# EAGLE design DC24_HHV_RE-revp1 (EAGLE 6.5.0)
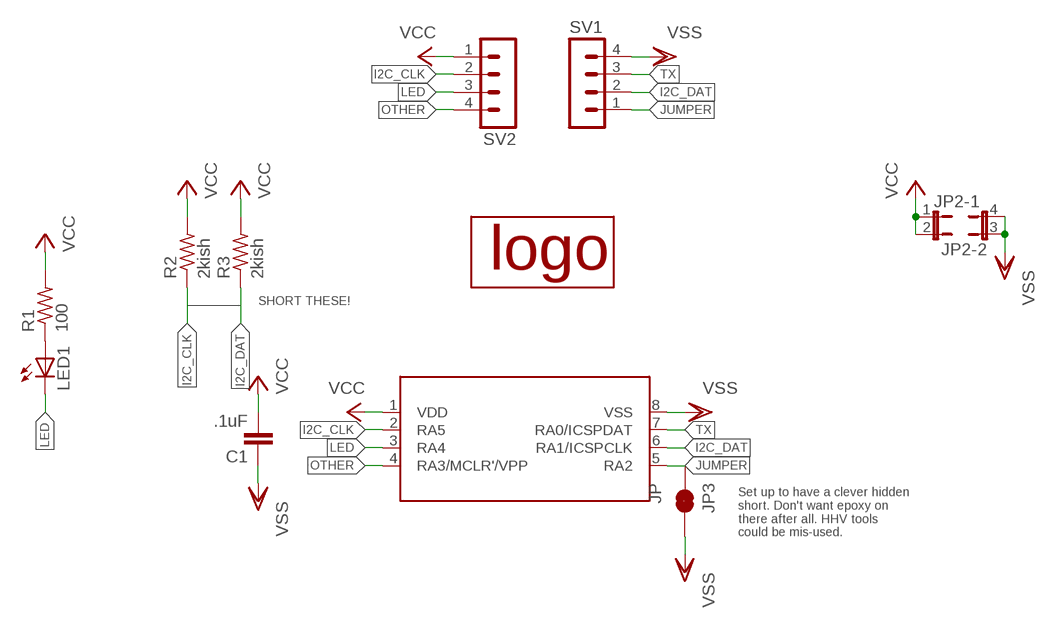
[diagram p0: schematic, sheet 1]

## Parts
C1  .1uF  C-EU050-024X044  [C050-024X044]
JP2  JP2QE  [JP2Q]
JP3  JP  JUMPER-PAD-2-NC_BY_TRACE  [PAD-JUMPER-2-NC_BY_TRACE_YES_SILK]
LED1  LED5MM  [LED5MM]
R1  100  R-US_0204/7  [0204/7]
R2  2kish  R-US_0204/7  [0204/7]
R3  2kish  R-US_0204/7  [0204/7]
SV1  MA04-1  [MA04-1]
SV2  MA04-1  [MA04-1]
U1  PIC12F1571  [DIL8]
U$1  KBELOGO-SILK  [KBELOGO-SILK]

## Nets
I2C_CLK: R2.1 SV2.2 U1.2(RA5)
I2C_DAT: R3.1 SV1.2 U1.6(RA1/ICSPCLK)
JUMPER: JP3.1 SV1.1 U1.5(RA2)
LED: LED1.K(C) SV2.3 U1.3(RA4)
N$3: LED1.A R1.1
OTHER: SV2.4 U1.4(RA3/MCLR'/VPP)
TX: SV1.3 U1.7(RA0/ICSPDAT)
VCC: C1.2 JP2.1 JP2.2 R1.2 R2.2 R3.2 SV2.1 U1.1(VDD)
VSS: C1.1 JP2.3 JP2.4 JP3.2 SV1.4 U1.8(VSS)

## Notes on the sheet
- SHORT THESE!
- Set up to have a clever hidden
  short. Don't want epoxy on
  there after all. HHV tools
  could be mis-used.

## Library data of the parts
C1 = rcl:C-EU: CAPACITOR, European symbol
JP2 = jumper:JP2QE: JUMPER
JP3 = SparkFun-Passives:JUMPER-PAD-2-NC_BY_TRACE
LED1 = led:LED: LED OSRAM: - CHIPLED LG R971, LG N971, LY N971, LG Q971, LY Q971, LO R971, LY R971 LH N974, LH R974 LS Q976, LO Q976, LY Q976 LO Q996 - Hyper CHIPLED LW Q18S LB Q993, LB Q99A, LB R99A - SideLED LS A670, LO A670, LY A670, LG A670, LP A670 LB A673, LV A673, LT A673, LW A673 LH A674 LY A675 LS A676, LA A676, LO A676, LY A676, LW A676 LS A679, LY A679, LG A679 - Hyper Micro SIDELED® LS Y876, LA Y876, LO Y876, LY Y876 LT Y87S - SmartLED LW L88C, LW L88S LB L89C, LB L89S, LG L890 LS L89K, LO L89K, LY L89K LS L896, LA L896, LO L896, LY L896 - TOPLED LS T670, LO T670, LY T670, LG T670, LP T670 LSG T670, LSP T670, LSY T670, LOP T670, LYG T670 LG T671, LOG T671, LSG T671 LB T673, LV T673, LT T673, LW T673 LH T674 LS T676, LA T676, LO T676, LY T676, LB T676, LH T676, LSB T676, LW T676 LB T67C, LV T67C, LT T67C, LS T67K, LO T67K, LY T67K, LW E67C LS E67B, LA E67B, LO E67B, LY E67B, LB E67C, LV E67C, LT E67C LW T67C LS T679, LY T679, LG T679 LS T770, LO T770, LY T770, LG T770, LP T770 LB T773, LV T773, LT T773, LW T773 LH T774 LS E675, LA E675, LY E675, LS T675 LS T776, LA T776, LO T776, LY T776, LB T776 LHGB T686 LT T68C, LB T68C - Hyper Mini TOPLED® LB M676 - Mini TOPLED Santana® LG M470 LS M47K, LO M47K, LY M47K Source: http://www.osram.convergy.de LUXEON: - LUMILED® LXK2-PW12-R00, LXK2-PW12-S00, LXK2-PW14-U00, LXK2-PW14-V00 LXK2-PM12-R00, LXK2-PM12-S00, LXK2-PM14-U00 LXK2-PE12-Q00, LXK2-PE12-R00, LXK2-PE12-S00, LXK2-PE14-T00, LXK2-PE14-U00 LXK2-PB12-K00, LXK2-PB12-L00, LXK2-PB12-M00, LXK2-PB14-N00, LXK2-PB14-P00, LXK2-PB14-Q00 LXK2-PR12-L00, LXK2-PR12-M00, LXK2-PR14-Q00, LXK2-PR14-R00 LXK2-PD12-Q00, LXK2-PD12-R00, LXK2-PD12-S00 LXK2-PH12-R00, LXK2-PH12-S00 LXK2-PL12-P00, LXK2-PL12-Q00, LXK2-PL12-R00 Source: www.luxeon.com KINGBRIGHT: KA-3528ASYC Source: www.kingbright.com
R1-R3 = rcl:R-US_: RESISTOR, American symbol
SV1 SV2 = con-lstb:MA04-1: PIN HEADER; OC_FARNELL: unknown; OC_NEWARK: unknown
U1 = cuslibrary:PIC12F1571
U$1 = cuslibrary:KBELOGO-SILK

## Board
DC24 HHV Reverse Engineering Challenge
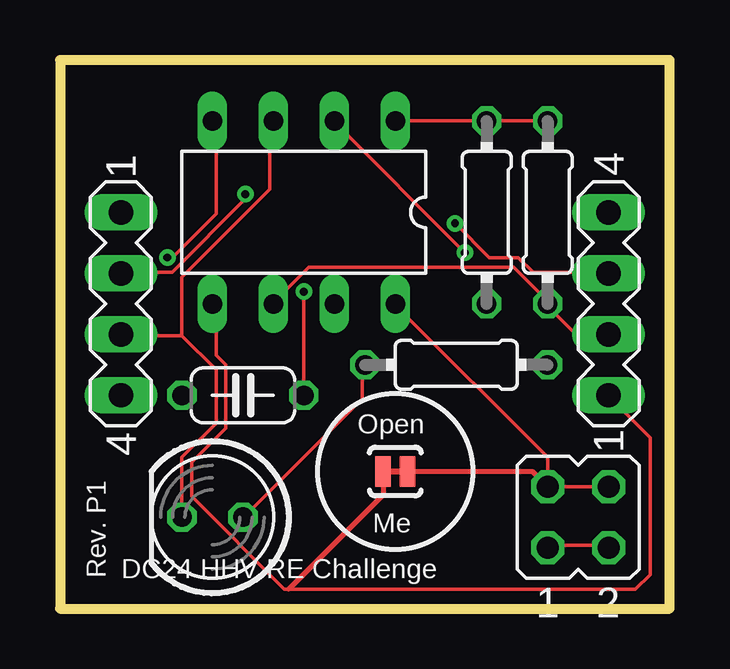
[diagram p1: board, top side]
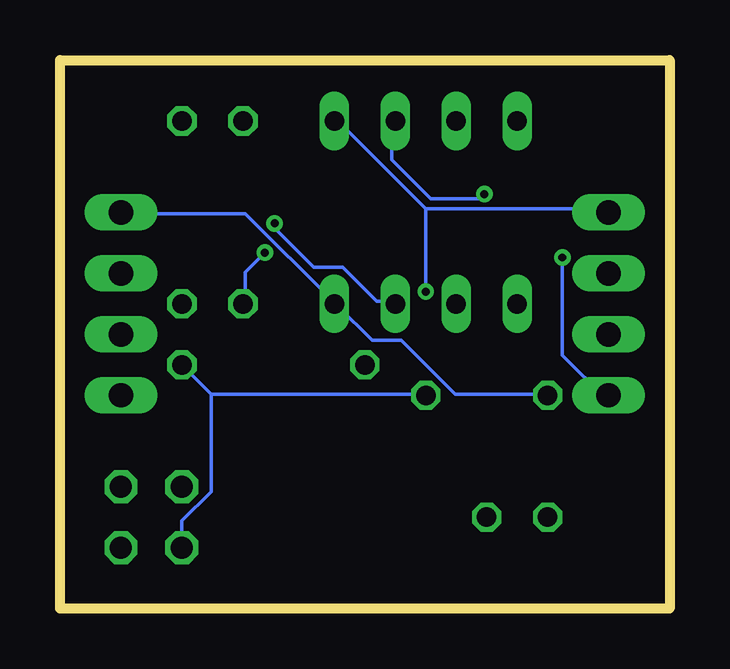
[diagram p2: board, bottom side, seen from below]

Size 25.4 x 22.86 mm. Coordinates in mm from the lower left corner, seen from the top.
Outline: 0,0 25.4,0 25.4,22.86 0,22.86 0,0
Copper layers (1*16): Top 0.0356mm / dielectric 1.5011mm / Bottom 0.0356mm
Design rules "OSHPark": minimum track width 6mil, minimum drill 13mil, track to track 6mil, track to pad 6mil, pad to pad 6mil, via to via 6mil, smd to smd 6mil, copper to edge 15mil, drill to drill 6mil, minimum pad ring 7mil, minimum via ring 7mil, stop-mask expansion 3mil, vias tented up to drill 0mil, thermal gap 10mil

### Footprints (pad centres in the part's own frame; a part is rotated, then mirrored left to right if it is on the bottom)
C050-024X044 = drill 0.813 octagon: 1 -2.54,0; 2 2.54,0
JP2Q = drill 0.914 octagon: 1 -1.27,-1.27; 2 1.27,-1.27; 3 -1.27,1.27; 4 1.27,1.27
PAD-JUMPER-2-NC_BY_TRACE_YES_SILK = smd 0.635 x 1.27: 1 -0.508,0; 2 0.508,0
LED5MM = drill 0.813 octagon: A -1.27,0; K 1.27,0
0204/7 = drill 0.813 octagon: 1 -3.81,0; 2 3.81,0
MA04-1 = drill 1.016 long: 1 -3.81,0; 2 -1.27,0; 3 1.27,0; 4 3.81,0
DIL8 = drill 0.813 long: 1 -3.81,-3.81; 2 -1.27,-3.81; 3 1.27,-3.81; 4 3.81,-3.81; 5 3.81,3.81; 6 1.27,3.81; 7 -1.27,3.81; 8 -3.81,3.81

### Placement (x,y rotation side)
C1  7.62,8.89 0 top
JP2  21.59,3.81 0 top
JP3  13.97,5.71 0 top
LED1  6.35,3.81 180 top
R1  16.51,10.16 0 top
R2  17.78,16.51 90 top
R3  20.32,16.51 90 top
SV1  22.86,12.7 90 top
SV2  2.54,12.7 270 top
U1  10.16,16.51 180 top
U$1  5.71,14.61 0 top

### Tracks (layer width: path | path; a pad name or v marks a point on that pad's centre or on a via)
I2C_CLK  (via drill 0.33)
  Top 0.152: v7.72,17.27 7.72,17.07 4.67,14.02 2.64,14.02 SV2.2 | v16.87,14.83 11.38,20.32 U1.2
  Bottom 0.152: v7.72,17.27 7.92,17.07 9.96,17.07 11.58,18.69 11.58,20.32 U1.2 | v16.87,14.83 17.68,14.02 17.68,12.8 R2.1
I2C_DAT
  Top 0.152: U1.6 8.94,12.8 10.36,14.22 18.9,14.22 20.32,12.8 R3.1 20.32,12.6 21.34,11.58 22.76,11.58 SV1.2
JUMPER
  Top 0.152: U1.5 6.5,12.6 6.5,10.57 6.91,10.16 6.91,7.52 5.49,6.1 5.49,4.67 9.35,0.81 9.53,0.81 23.98,0.81 24.59,1.42 24.59,7.11 22.96,8.74 SV1.1
  Top 0.203: JP3.1 13.46,4.75 9.53,0.81
LED
  Top 0.152: LED1.K 5.08,6.3 6.5,7.72 6.5,9.96 5.08,11.38 | 5.08,11.38 2.64,11.38 SV2.3 | 5.08,11.38 5.08,13.82 8.74,17.48 8.74,20.32 U1.3
N$3
  Top 0.152: LED1.A 7.72,3.86 12.6,8.74 12.6,10.16 R1.1
OTHER  (via drill 0.33)
  Top 0.152: v4.47,14.63 4.67,14.63 6.5,16.46 6.5,20.32 U1.4
  Bottom 0.152: v4.47,14.63 4.47,10.57 2.64,8.74 SV2.4
TX  (via drill 0.33)
  Top 0.152: v16.46,16.05 17.88,14.63 19.1,14.63 19.71,14.02 22.76,14.02 SV1.3
  Bottom 0.152: v16.46,16.05 16.46,15.85 14.83,14.22 13.61,14.22 12.19,12.8 11.58,12.8 U1.7
VCC  (via drill 0.33)
  Top 0.152: JP2.1 20.32,2.64 22.76,2.64 JP2.2 | U1.1 R2.2 R3.2 | v10.16,13.21 C1.2
  Bottom 0.152: 19.1,8.94 10.16,8.94 C1.2 | R1.2 19.1,8.94 | JP2.1 20.32,3.66 19.1,4.88 19.1,8.94 | 10.16,16.66 2.64,16.66 SV2.1 | 10.16,16.66 13.82,20.32 U1.1 | 10.16,16.66 v10.16,13.21
VSS
  Top 0.152: JP2.4 JP2.3 20.32,6.3 14.02,12.6 U1.8
  Top 0.203: JP3.2 19.68,5.71 JP2.3
  Bottom 0.152: C1.1 5.08,8.94 8.94,8.94 11.18,11.18 12.39,11.18 13.82,12.6 U1.8 14.02,12.8 17.68,16.46 22.76,16.46 SV1.4

### Text on the board
tPlace: Open | Me | Rev. P1
tNames: DC24 HHV RE Challenge